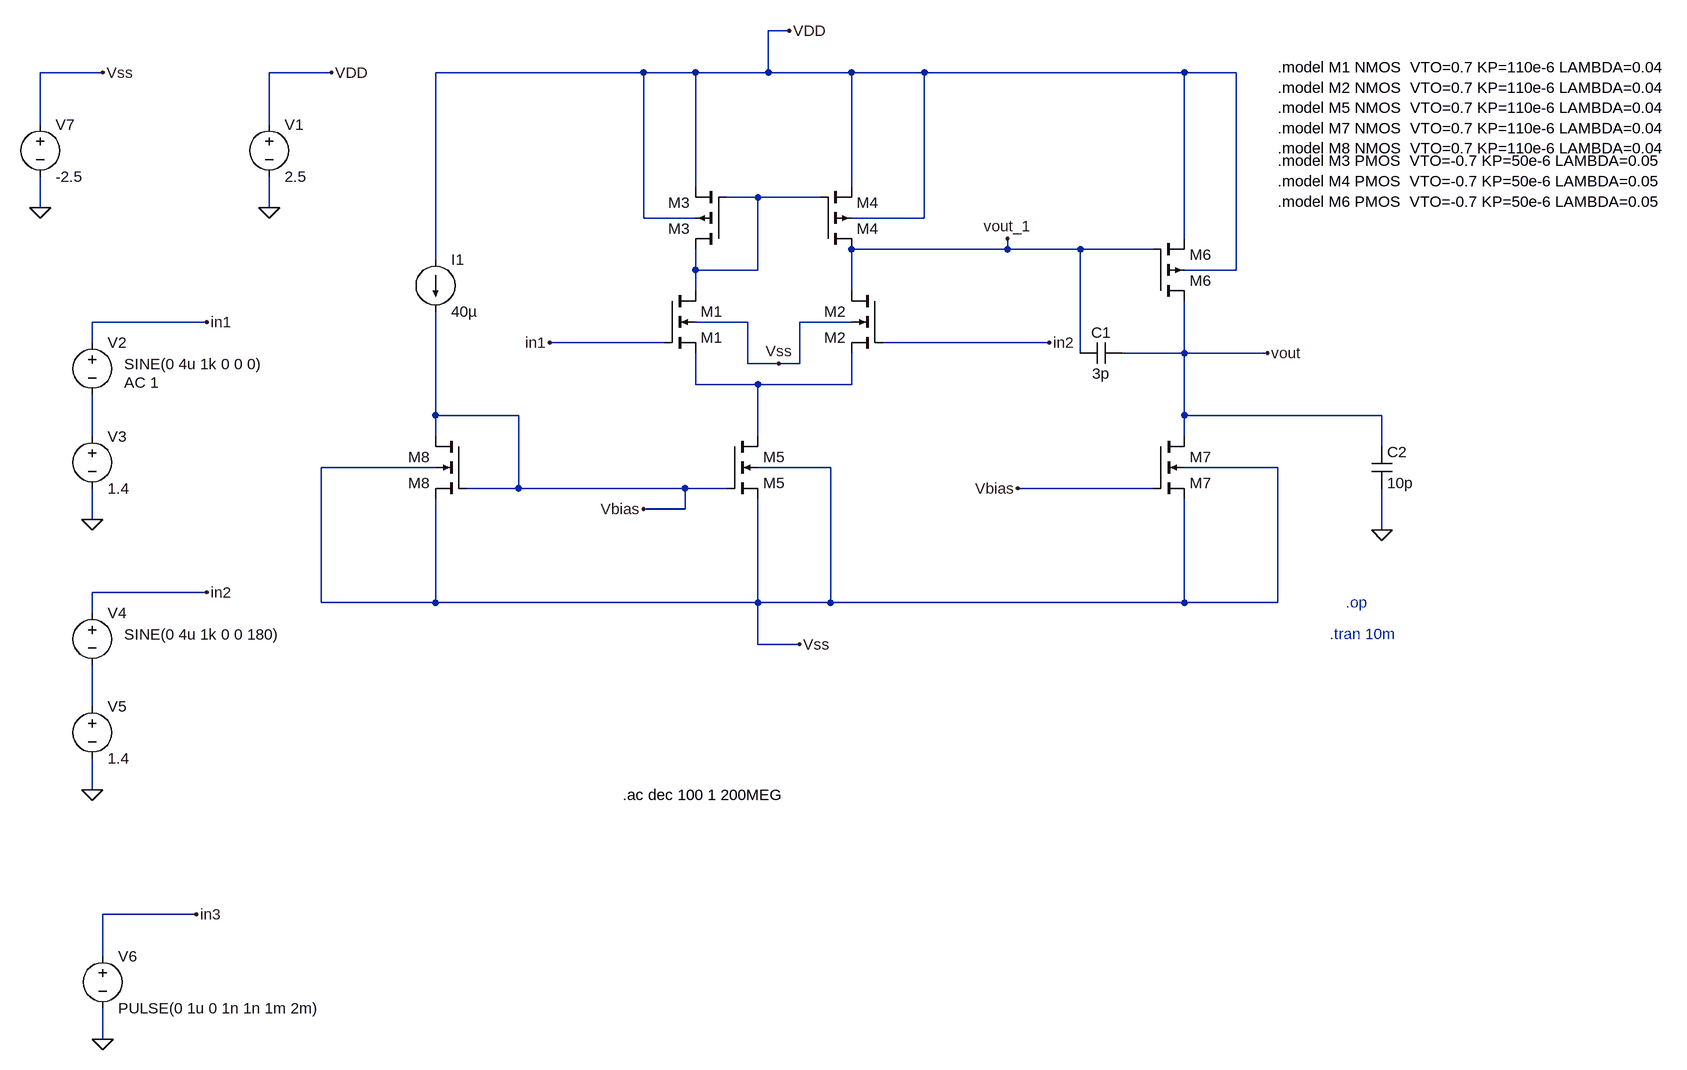
[diagram p0: schematic final_nmos1.asc]
final_nmos1.asc, the LTspice schematic file:
Version 4.1
SHEET 1 1800 1268
WIRE 336 -304 304 -304
WIRE -720 -240 -816 -240
WIRE -368 -240 -464 -240
WIRE 112 -240 -208 -240
WIRE 192 -240 112 -240
WIRE 304 -240 304 -304
WIRE 304 -240 192 -240
WIRE 432 -240 304 -240
WIRE 544 -240 432 -240
WIRE 944 -240 544 -240
WIRE 1024 -240 944 -240
WIRE -816 -160 -816 -240
WIRE -464 -160 -464 -240
WIRE 192 -64 192 -240
WIRE 432 -64 432 -240
WIRE 288 -48 240 -48
WIRE 384 -48 288 -48
WIRE -816 -32 -816 -80
WIRE -464 -32 -464 -80
WIRE 112 -16 112 -240
WIRE 192 -16 112 -16
WIRE 544 -16 544 -240
WIRE 544 -16 432 -16
WIRE 944 16 944 -240
WIRE 672 32 672 16
WIRE 672 32 432 32
WIRE 784 32 672 32
WIRE 896 32 784 32
WIRE -208 48 -208 -240
WIRE 192 64 192 32
WIRE 288 64 288 -48
WIRE 288 64 192 64
WIRE 1024 64 1024 -240
WIRE 1024 64 944 64
WIRE 192 96 192 64
WIRE 432 96 432 32
WIRE -560 144 -736 144
WIRE 272 144 192 144
WIRE 432 144 352 144
WIRE -736 176 -736 144
WIRE 144 176 -32 176
WIRE 736 176 480 176
WIRE 784 192 784 32
WIRE 944 192 944 112
WIRE 944 192 848 192
WIRE 1072 192 944 192
WIRE 272 208 272 144
WIRE 320 208 272 208
WIRE 352 208 352 144
WIRE 352 208 320 208
WIRE 192 240 192 192
WIRE 288 240 192 240
WIRE 432 240 432 192
WIRE 432 240 288 240
WIRE -208 288 -208 128
WIRE -80 288 -208 288
WIRE 944 288 944 192
WIRE 1248 288 944 288
WIRE -736 320 -736 256
WIRE -208 320 -208 288
WIRE 288 320 288 240
WIRE 944 320 944 288
WIRE 1248 336 1248 288
WIRE -208 368 -384 368
WIRE 400 368 288 368
WIRE 1088 368 944 368
WIRE -80 400 -80 288
WIRE -80 400 -160 400
WIRE 176 400 -80 400
WIRE 240 400 176 400
WIRE 896 400 688 400
WIRE 176 432 176 400
WIRE 176 432 112 432
WIRE -736 448 -736 400
WIRE 1248 464 1248 400
WIRE -560 560 -736 560
WIRE -384 576 -384 368
WIRE -208 576 -208 416
WIRE -208 576 -384 576
WIRE 288 576 288 416
WIRE 288 576 -208 576
WIRE 400 576 400 368
WIRE 400 576 288 576
WIRE 944 576 944 416
WIRE 944 576 400 576
WIRE 1088 576 1088 368
WIRE 1088 576 944 576
WIRE -736 592 -736 560
WIRE 288 640 288 576
WIRE 352 640 288 640
WIRE -736 736 -736 672
WIRE -736 864 -736 816
WIRE -576 1056 -720 1056
WIRE -720 1120 -720 1056
WIRE -720 1248 -720 1200
FLAG 112 432 Vbias
FLAG 688 400 Vbias
FLAG 1248 464 0
FLAG -464 -32 0
FLAG -368 -240 VDD
FLAG 336 -304 VDD
FLAG -736 448 0
FLAG -560 144 in1
FLAG -736 864 0
FLAG -560 560 in2
FLAG 1072 192 vout
FLAG 672 16 vout_1
FLAG -720 1248 0
FLAG -576 1056 in3
FLAG 352 640 Vss
FLAG 320 208 Vss
FLAG -816 -32 0
FLAG -720 -240 Vss
FLAG -32 176 in1
FLAG 736 176 in2
SYMBOL nmos4 144 96 R0
SYMATTR InstName M1
SYMATTR Value M1
SYMATTR Value2 l=1u w=3u
SYMBOL nmos4 480 96 M0
SYMATTR InstName M2
SYMATTR Value M2
SYMATTR Value2 l=1u w=3u
SYMBOL nmos4 240 320 R0
SYMATTR InstName M5
SYMATTR Value M5
SYMATTR Value2 l=1u w=15u
SYMBOL nmos4 896 320 R0
SYMATTR InstName M7
SYMATTR Value M7
SYMATTR Value2 l=1u w=43u
SYMBOL nmos4 -160 320 M0
SYMATTR InstName M8
SYMATTR Value M8
SYMATTR Value2 l=1u w=15u
SYMBOL pmos4 240 32 R180
SYMATTR InstName M3
SYMATTR Value M3
SYMATTR Value2 l=1u w=20u
SYMBOL pmos4 384 32 M180
SYMATTR InstName M4
SYMATTR Value M4
SYMATTR Value2 l=1u w=20u
SYMBOL pmos4 896 112 M180
SYMATTR InstName M6
SYMATTR Value M6
SYMATTR Value2 l=1u w=114u
SYMBOL current -208 48 R0
WINDOW 123 0 0 Left 0
WINDOW 39 0 0 Left 0
SYMATTR InstName I1
SYMATTR Value 40µ
SYMBOL cap 848 176 R90
WINDOW 0 0 32 VBottom 2
WINDOW 3 32 32 VTop 2
SYMATTR InstName C1
SYMATTR Value 3p
SYMBOL cap 1232 336 R0
SYMATTR InstName C2
SYMATTR Value 10p
SYMBOL voltage -464 -176 R0
WINDOW 123 0 0 Left 0
WINDOW 39 0 0 Left 0
SYMATTR InstName V1
SYMATTR Value 2.5
SYMBOL voltage -736 160 R0
WINDOW 3 49 49 Left 2
WINDOW 123 49 77 Left 2
WINDOW 39 0 0 Left 0
SYMATTR Value SINE(0 4u 1k 0 0 0)
SYMATTR Value2 AC 1
SYMATTR InstName V2
SYMBOL voltage -736 304 R0
WINDOW 123 0 0 Left 0
WINDOW 39 0 0 Left 0
SYMATTR InstName V3
SYMATTR Value 1.4
SYMBOL voltage -736 576 R0
WINDOW 3 49 49 Left 2
WINDOW 123 0 0 Left 0
WINDOW 39 0 0 Left 0
SYMATTR Value SINE(0 4u 1k 0 0 180)
SYMATTR InstName V4
SYMBOL voltage -736 720 R0
WINDOW 123 0 0 Left 0
WINDOW 39 0 0 Left 0
SYMATTR InstName V5
SYMATTR Value 1.4
SYMBOL voltage -720 1104 R0
WINDOW 123 0 0 Left 0
WINDOW 39 0 0 Left 0
SYMATTR InstName V6
SYMATTR Value PULSE(0 1u 0 1n 1n 1m 2m)
SYMBOL voltage -816 -176 R0
WINDOW 123 0 0 Left 0
WINDOW 39 0 0 Left 0
SYMATTR InstName V7
SYMATTR Value -2.5
TEXT 1088 -248 Left 2 !.model M1 NMOS  VTO=0.7 KP=110e-6 LAMBDA=0.04\n.model M2 NMOS  VTO=0.7 KP=110e-6 LAMBDA=0.04\n.model M5 NMOS  VTO=0.7 KP=110e-6 LAMBDA=0.04\n.model M7 NMOS  VTO=0.7 KP=110e-6 LAMBDA=0.04\n.model M8 NMOS  VTO=0.7 KP=110e-6 LAMBDA=0.04
TEXT 1088 -104 Left 2 !.model M3 PMOS  VTO=-0.7 KP=50e-6 LAMBDA=0.05\n.model M4 PMOS  VTO=-0.7 KP=50e-6 LAMBDA=0.05\n.model M6 PMOS  VTO=-0.7 KP=50e-6 LAMBDA=0.05
TEXT 1192 576 Left 2 ;.op
TEXT 1168 624 Left 2 ;.tran 10m
TEXT 80 872 Left 2 !.ac dec 100 1 200MEG

The netlist it stands for:
* final_nmos1.asc
M1 N001 in1 N002 Vss M1 l=1u w=3u
M2 vout_1 in2 N002 Vss M2 l=1u w=3u
M5 N002 Vbias Vss Vss M5 l=1u w=15u
M7 vout Vbias Vss Vss M7 l=1u w=43u
M8 Vbias Vbias Vss Vss M8 l=1u w=15u
M3 N001 N001 VDD VDD M3 l=1u w=20u
M4 vout_1 N001 VDD VDD M4 l=1u w=20u
M6 vout vout_1 VDD VDD M6 l=1u w=114u
I1 VDD Vbias 40µ
C1 vout vout_1 3p
C2 vout 0 10p
V1 VDD 0 2.5
V2 in1 N003 SINE(0 4u 1k 0 0 0) AC 1
V3 N003 0 1.4
V4 in2 N004 SINE(0 4u 1k 0 0 180)
V5 N004 0 1.4
V6 in3 0 PULSE(0 1u 0 1n 1n 1m 2m)
V7 Vss 0 -2.5
.model NMOS NMOS
.model PMOS PMOS
.lib standard.mos
.model M1 NMOS  VTO=0.7 KP=110e-6 LAMBDA=0.04
.model M2 NMOS  VTO=0.7 KP=110e-6 LAMBDA=0.04
.model M5 NMOS  VTO=0.7 KP=110e-6 LAMBDA=0.04
.model M7 NMOS  VTO=0.7 KP=110e-6 LAMBDA=0.04
.model M8 NMOS  VTO=0.7 KP=110e-6 LAMBDA=0.04
.model M3 PMOS  VTO=-0.7 KP=50e-6 LAMBDA=0.05
.model M4 PMOS  VTO=-0.7 KP=50e-6 LAMBDA=0.05
.model M6 PMOS  VTO=-0.7 KP=50e-6 LAMBDA=0.05
* .op
* .tran 10m
.ac dec 100 1 200MEG
.backanno
.end